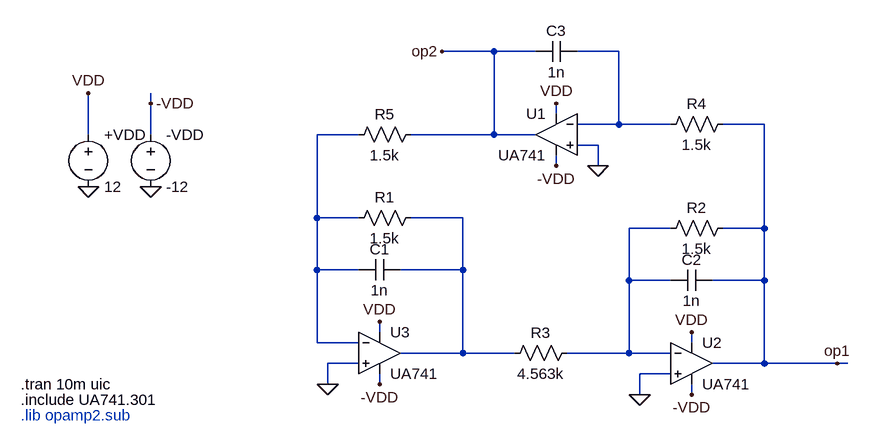
[diagram p0: schematic QA3.asc]
QA3.asc, the LTspice schematic file:
Version 4
SHEET 1 880 752
WIRE 160 -16 80 -16
WIRE 224 -16 160 -16
WIRE 352 -16 288 -16
WIRE -368 64 -368 48
WIRE 256 80 256 64
WIRE 352 96 352 -16
WIRE 352 96 288 96
WIRE 432 96 352 96
WIRE 576 96 512 96
WIRE -464 112 -464 48
WIRE -368 112 -368 64
WIRE -48 112 -112 112
WIRE 160 112 160 -16
WIRE 160 112 32 112
WIRE 224 112 160 112
WIRE 320 128 288 128
WIRE 256 160 256 144
WIRE 320 160 320 128
WIRE -112 240 -112 112
WIRE -48 240 -112 240
WIRE 112 240 32 240
WIRE 432 256 368 256
WIRE 576 256 576 96
WIRE 576 256 512 256
WIRE -112 320 -112 240
WIRE -48 320 -112 320
WIRE 112 320 112 240
WIRE 112 320 16 320
WIRE 368 336 368 256
WIRE 432 336 368 336
WIRE 576 336 576 256
WIRE 576 336 496 336
WIRE -16 416 -16 400
WIRE -112 432 -112 320
WIRE -48 432 -112 432
WIRE 464 432 464 416
WIRE 112 448 112 320
WIRE 112 448 16 448
WIRE 192 448 112 448
WIRE 368 448 368 336
WIRE 368 448 272 448
WIRE 432 448 368 448
WIRE -48 464 -96 464
WIRE 576 464 576 336
WIRE 576 464 496 464
WIRE 688 464 576 464
WIRE 704 464 688 464
WIRE 432 480 384 480
WIRE -96 496 -96 464
WIRE -16 496 -16 480
WIRE 384 512 384 480
WIRE 464 512 464 496
FLAG 320 160 0
FLAG 384 512 0
FLAG -96 496 0
FLAG 688 464 op1
FLAG 80 -16 op2
FLAG -368 192 0
FLAG -464 192 0
FLAG -464 48 VDD
FLAG -368 64 -VDD
FLAG 256 64 VDD
FLAG 256 160 -VDD
FLAG -16 400 VDD
FLAG -16 496 -VDD
FLAG 464 416 VDD
FLAG 464 512 -VDD
SYMBOL cap 288 -32 R90
WINDOW 0 0 32 VBottom 2
WINDOW 3 32 32 VTop 2
SYMATTR InstName C3
SYMATTR Value 1n
SYMBOL cap 496 320 R90
WINDOW 0 0 32 VBottom 2
WINDOW 3 32 32 VTop 2
SYMATTR InstName C2
SYMATTR Value 1n
SYMBOL cap 16 304 R90
WINDOW 0 0 32 VBottom 2
WINDOW 3 32 32 VTop 2
SYMATTR InstName C1
SYMATTR Value 1n
SYMBOL res 528 240 R90
WINDOW 0 0 56 VBottom 2
WINDOW 3 32 56 VTop 2
SYMATTR InstName R2
SYMATTR Value 1.5k
SYMBOL res 48 224 R90
WINDOW 0 0 56 VBottom 2
WINDOW 3 32 56 VTop 2
SYMATTR InstName R1
SYMATTR Value 1.5k
SYMBOL res 48 96 R90
WINDOW 0 0 56 VBottom 2
WINDOW 3 32 56 VTop 2
SYMATTR InstName R5
SYMATTR Value 1.5k
SYMBOL res 528 80 R90
WINDOW 0 0 56 VBottom 2
WINDOW 3 32 56 VTop 2
SYMATTR InstName R4
SYMATTR Value 1.5k
SYMBOL res 288 432 R90
WINDOW 0 0 56 VBottom 2
WINDOW 3 32 56 VTop 2
SYMATTR InstName R3
SYMATTR Value 4.563k
SYMBOL OpAmps/opamp2 256 48 M0
SYMATTR InstName U1
SYMATTR Value UA741
SYMBOL OpAmps/opamp2 464 400 R0
SYMATTR InstName U2
SYMATTR Value UA741
SYMBOL OpAmps/opamp2 -16 384 R0
SYMATTR InstName U3
SYMATTR Value UA741
SYMBOL voltage -464 96 R0
SYMATTR InstName +VDD
SYMATTR Value 12
SYMBOL voltage -368 96 R0
SYMATTR InstName -VDD
SYMATTR Value -12
TEXT -568 496 Left 2 !.tran 10m uic
TEXT -568 520 Left 2 !.include UA741.301
TEXT -568 544 Left 2 ;.lib opamp2.sub

The netlist it stands for:
* QA3.asc
C3 N001 op2 1n
C2 op1 N004 1n
C1 N003 N002 1n
R2 op1 N004 1.5k
R1 N003 N002 1.5k
R5 op2 N002 1.5k
R4 op1 N001 1.5k
R3 N004 N003 4.563k
XU1 0 N001 VDD -VDD op2 UA741  ; pins In+ In- V+ V- OUT
XU2 0 N004 VDD -VDD op1 UA741  ; pins In+ In- V+ V- OUT
XU3 0 N002 VDD -VDD N003 UA741  ; pins In+ In- V+ V- OUT
V§+VDD VDD 0 12
V§-VDD -VDD 0 -12
.tran 10m uic
.include UA741.301
* .lib opamp2.sub
.backanno
.end